# Altium schematic sheet pt100.SchDoc
size A4
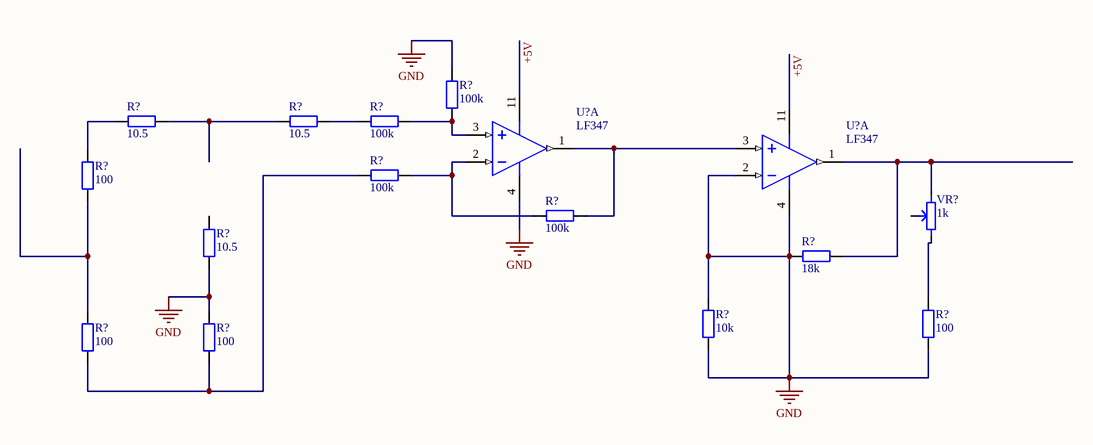
[diagram p0: pt100.SchDoc]

## Parts
(Parts that share a designator on the sheet are numbered #1, #2 ... from top to bottom, then left to right.)
R?#1  100k  [Tro SMD 0805]
R?#2  10.5  [Tro SMD 0805]
R?#3  10.5  [Tro SMD 0805]
R?#4  100k  [Tro SMD 0805]
R?#5  100  [Tro SMD 0805]
R?#6  100k  [Tro SMD 0805]
R?#7  100k  [Tro SMD 0805]
R?#8  10.5  [Tro SMD 0805]
R?#9  18k  [Tro SMD 0805]
R?#10  10k  [Tro SMD 0805]
R?#11  100  [Tro SMD 0805]
R?#12  100  [Tro SMD 0805]
R?#13  100  [Tro SMD 0805]
U?#1  LF347  [DIP14]  (part A of 4)
U?#2  LF347  [DIP14]  (part A of 4)
VR?  1k  [VR Tam Giac]

## Nets
GND: R?#1.2 R?#8.1 R?#9.2 R?#10.1 R?#10.2 R?#11.2 R?#13.2 U?#1.4(VCC) U?#2.2(1_IN-) U?#2.4(VCC)
+5V: U?#1.11(VEE) U?#2.11(VEE)
NetR?#1_1: R?#1.1 R?#4.2 U?#1.3(1_IN+)
NetR?#2_1: R?#2.1 R?#5.2
NetR?#2_2: R?#2.2 R?#3.1
NetR?#3_2: R?#3.2 R?#4.1
NetR?#5_1: R?#5.1 R?#12.2
NetR?#6_1: R?#6.1 R?#12.1 R?#13.1
NetR?#6_2: R?#6.2 R?#7.1 U?#1.2(1_IN-)
NetR?#7_2: R?#7.2 U?#1.1(1_OUT) U?#2.3(1_IN+)
NetR?#9_1: R?#9.1 U?#2.1(1_OUT) VR?.1
NetR?#11_1: R?#11.1 VR?.3

Not connected (* = marked no-connect by the designer): R?#8 2; VR? 2

## Library data of the parts
R?#1-R?#13 = Tro 0805 5% 82k: Dán; Don_Vi: Con; So_Chan: 2; Ten_Linh_Kien: Trở 0805 5% 82k; Ma_Hang: MH005329; Chung_Loai: Dán; Kieu_Chan: *
U?#1 U?#2 = LF347: Low Power Quad Operational Amplifier; Manufacturer Part Number: LF347BD; Manufacturer: Texas Instruments; Text Field1: pristel=Nsc\nsanopea\<parttype>.ckt; Slew Rate: 13 V/µs; Voltage - Supply, Single/Dual (±): 7 V ~ 36 V, ±3.5 V ~ 18 V; Current - Input Bias: 50pA; Voltage - Input Offset: 3000µV; Number of Circuits: 4; Gain Bandwidth Product: 3MHz; Amplifier Type: J-FET; Current - Supply: 8mA; Supplier 1: Digi-Key; Supplier Part Number 1: 296-7136-5-ND; Package / Case: 14-SOIC (3.9mm Width), 14-SOL; Supplier: Digi-Key; Current - Output / Channel: -; Packaging: Tube; RoHS: RoHS Compliant; Output Type: -; Operating Temperature: 0°C ~ 70°C; Category: Integrated Circuits (ICs); Supplier Part Number: 296-7136-5-ND
VR? = Bien tro tam giac 10K: Cắm; Ma_Hang: MH000919; Don_Vi: Con; Ten_Linh_Kien: Biến Trở Tam Giác 103-10K RM065 (Chân Đứng); Chung_Loai: Cắm; Kieu_Chan: *